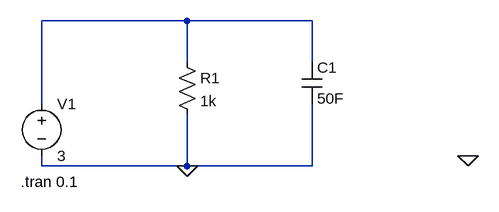
[diagram p0: schematic RC circuit.asc]
RC circuit.asc, the LTspice schematic file:
Version 4
SHEET 1 880 680
WIRE -144 32 -368 32
WIRE 48 32 -144 32
WIRE -144 96 -144 32
WIRE 48 96 48 32
WIRE -368 160 -368 32
WIRE -368 256 -368 240
WIRE -144 256 -144 176
WIRE -144 256 -368 256
WIRE 48 256 48 160
WIRE 48 256 -144 256
FLAG 288 240 0
FLAG -144 256 0
SYMBOL cap 32 96 R0
SYMATTR InstName C1
SYMATTR Value 50F
SYMBOL res -160 80 R0
SYMATTR InstName R1
SYMATTR Value 1k
SYMBOL voltage -368 144 R0
WINDOW 123 0 0 Left 0
WINDOW 39 0 0 Left 0
SYMATTR InstName V1
SYMATTR Value 3
TEXT -400 280 Left 2 !.tran 0.1

The netlist it stands for:
* RC circuit.asc
C1 N001 0 50F
R1 N001 0 1k
V1 N001 0 3
.tran 0.1
.backanno
.end